# EasyEDA schematic SCH_TT5_14_2024-07-31.json
TITLE: Sheet_1; REV: 1.0; Date: 2023-05-14; Sheet: 1/1; Drawn By: zacakira; Company: Your Company
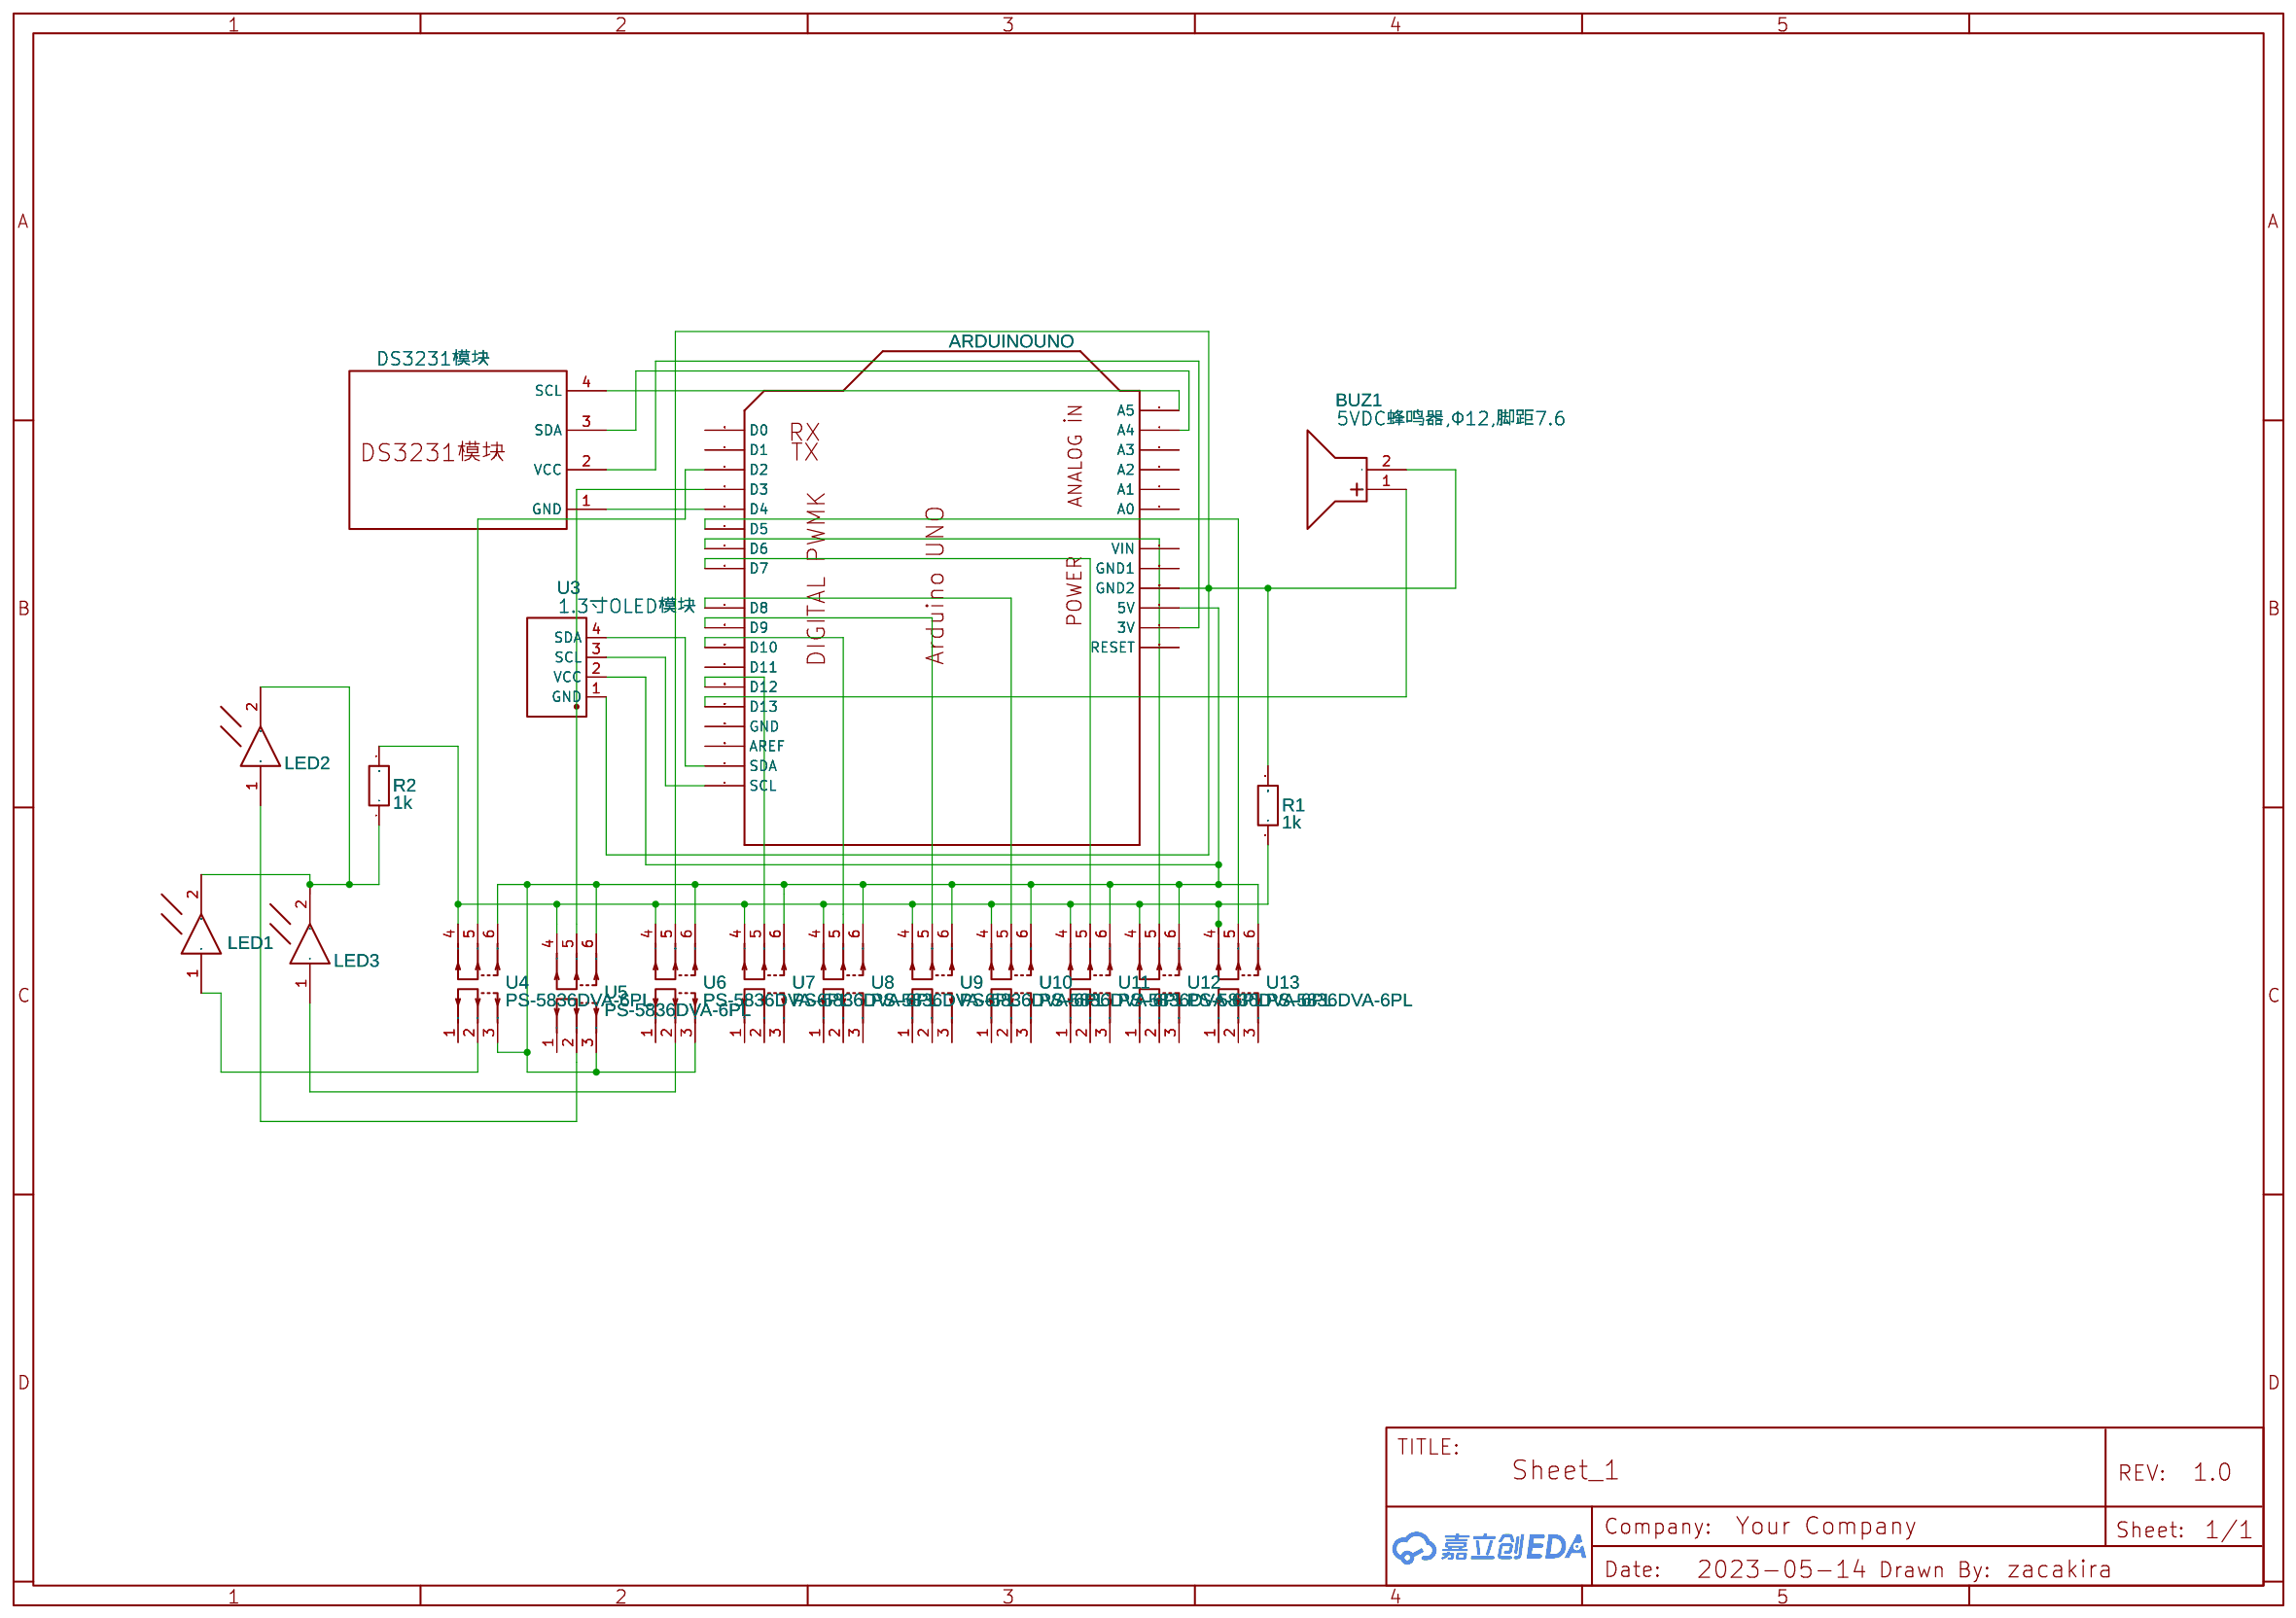
[diagram p0: schematic sheet]

## Parts
BUZ1  5VDC蜂鸣器,Φ12,脚距7.6  [BUZ-TH_BD12.0-P7.60-D0.6-FD]
R1  1k  [直插电阻1K]
R2  1k  [直插电阻1K]
U1  DS3231模块  [DS3231模块]
U2  ARDUINOUNO  [ARDUINOUNO]
U3  1.3寸OLED模块  [1.3寸OLED模块]
U4  PS-5836DVA-6PL  [SW-TH_6P-L5.8-W5.8-P2.00-LS4.5-BL]
U5  PS-5836DVA-6PL  [SW-TH_6P-L5.8-W5.8-P2.00-LS4.5-BL]
U6  PS-5836DVA-6PL  [SW-TH_6P-L5.8-W5.8-P2.00-LS4.5-BL]
U7  PS-5836DVA-6PL  [SW-TH_6P-L5.8-W5.8-P2.00-LS4.5-BL]
U8  PS-5836DVA-6PL  [SW-TH_6P-L5.8-W5.8-P2.00-LS4.5-BL]
U9  PS-5836DVA-6PL  [SW-TH_6P-L5.8-W5.8-P2.00-LS4.5-BL]
U10  PS-5836DVA-6PL  [SW-TH_6P-L5.8-W5.8-P2.00-LS4.5-BL]
U11  PS-5836DVA-6PL  [SW-TH_6P-L5.8-W5.8-P2.00-LS4.5-BL]
U12  PS-5836DVA-6PL  [SW-TH_6P-L5.8-W5.8-P2.00-LS4.5-BL]
U13  PS-5836DVA-6PL  [SW-TH_6P-L5.8-W5.8-P2.00-LS4.5-BL]
U14  LED1  [LED直插]
U15  LED2  [LED直插]
U16  LED3  [LED直插]

## Library data of the parts
BUZ1 = 5VDC蜂鸣器,Φ12,脚距7.6: Supplier: LCSC; Supplier Part: C9900018824; Manufacturer: null; JLCPCB Part Class: Extended Part; Contributor: lcsc
R1 R2 = 1k: Contributor: CYJ0015
U1 = DS3231模块: Contributor: lipk888
U2 = ARDUINOUNO COPY: Contributor: aimisi520
U3 = 1.3寸OLED模块: Contributor: LiChuang0000
U4-U13 = PS-5836DVA-6PL: Supplier: LCSC; Supplier Part: C5155596; Manufacturer: G-Switch(品赞); link: https://atta.szlcsc.com/upload/public/pdf/source/20220905/988812B5B08B6A5A4BD15DDC7EB1C2DD.pdf; Contributor: lcsc; JLCPCB Part Class: Extended Part
U14-U16 = LED（红色 直插）: Contributor: ksmdisi

## Nets
Net-(BUZ1-1): BUZ1.1(+) U2.D13
Net-(BUZ1-2): BUZ1.2(-) R1.2(0.5w) U1.1(GND) U2.D4 U2.GND2 U3.1(GND) U6.5
Net-(R1-1): R1.1 R2.2(0.5w) U4.4 U5.4 U6.4 U7.4 U8.4 U9.4 U10.4 U11.4 U12.4 U13.4
Net-(R2-1): R2.1 U14.2 U15.2 U16.2
Net-(U1-2): U1.2(VCC) U2.3V
Net-(U1-3): U1.3(SDA) U2.A4
Net-(U1-4): U1.4(SCL) U2.A5
Net-(U2-5V): U2.5V U3.2(VCC) U4.3 U4.6 U5.3 U5.6 U6.3 U6.6 U7.6 U8.6 U9.6 U10.6 U11.6 U12.6 U13.6
Net-(U2-D2): U2.D2 U4.5
Net-(U2-D3): U2.D3 U5.5
Net-(U2-D5): U2.D5 U13.5
Net-(U2-D6): U2.D6 U12.5
Net-(U2-D7): U2.D7 U11.5
Net-(U2-D8): U2.D8 U10.5
Net-(U2-D9): U2.D9 U9.5
Net-(U2-D10): U2.D10 U8.5
Net-(U2-D12): U2.D12 U7.5
Net-(U2-SCL): U2.SCL U3.3(SCL)
Net-(U2-SDA): U2.SDA U3.4(SDA)
Net-(U4-2): U4.2 U14.1
Net-(U5-2): U5.2 U15.1
Net-(U6-2): U6.2 U16.1

Not connected (* = marked no-connect by the designer): U2 A0 A1 A2 A3 AREF D0 D1 D11 GND GND1 RESET VIN; U4 1; U5 1; U6 1; U7 1 2 3; U8 1 2 3; U9 1 2 3; U10 1 2 3; U11 1 2 3; U12 1 2 3; U13 1 2 3
